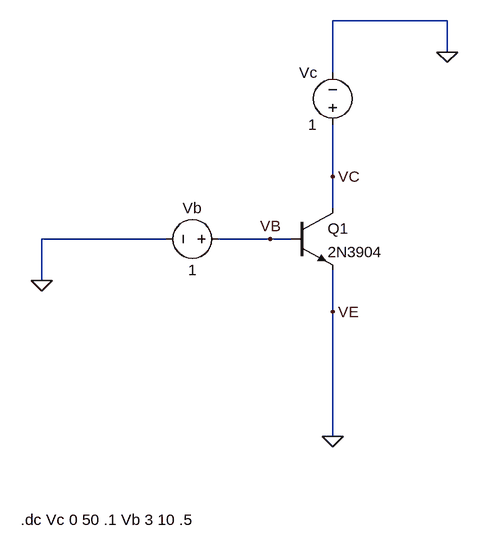
[diagram p0: schematic Gummel.asc]
Gummel.asc, the LTspice schematic file:
Version 4
SHEET 1 880 680
WIRE 384 -208 208 -208
WIRE 384 -160 384 -208
WIRE 208 -128 208 -208
WIRE 208 32 208 -48
WIRE 208 80 208 32
WIRE -48 128 -240 128
WIRE 112 128 32 128
WIRE 144 128 112 128
WIRE -240 192 -240 128
WIRE 208 240 208 176
WIRE 208 432 208 240
FLAG 208 432 0
FLAG -240 192 0
FLAG 208 32 VC
FLAG 208 240 VE
FLAG 112 128 VB
FLAG 384 -160 0
SYMBOL voltage 48 128 R90
WINDOW 0 -32 56 VBottom 2
WINDOW 3 32 56 VTop 2
SYMATTR InstName Vb
SYMATTR Value 1
SYMBOL npn 144 80 R0
SYMATTR InstName Q1
SYMATTR Value 2N3904
SYMBOL voltage 208 -32 R180
WINDOW 0 24 96 Left 2
WINDOW 3 24 16 Left 2
WINDOW 123 0 0 Left 0
WINDOW 39 0 0 Left 0
SYMATTR InstName Vc
SYMATTR Value 1
TEXT -272 560 Left 2 !.dc Vc 0 50 .1 Vb 3 10 .5

The netlist it stands for:
* Gummel.asc
Vb VB 0 1
Q1 VC VB 0 0 2N3904
Vc VC 0 1
.model NPN NPN
.model PNP PNP
.lib standard.bjt
.dc Vc 0 50 .1 Vb 3 10 .5
.backanno
.end